# Altium schematic sheet DisplayPort.SchDoc
size A3; SheetNumber: 7; SheetTotal: 13
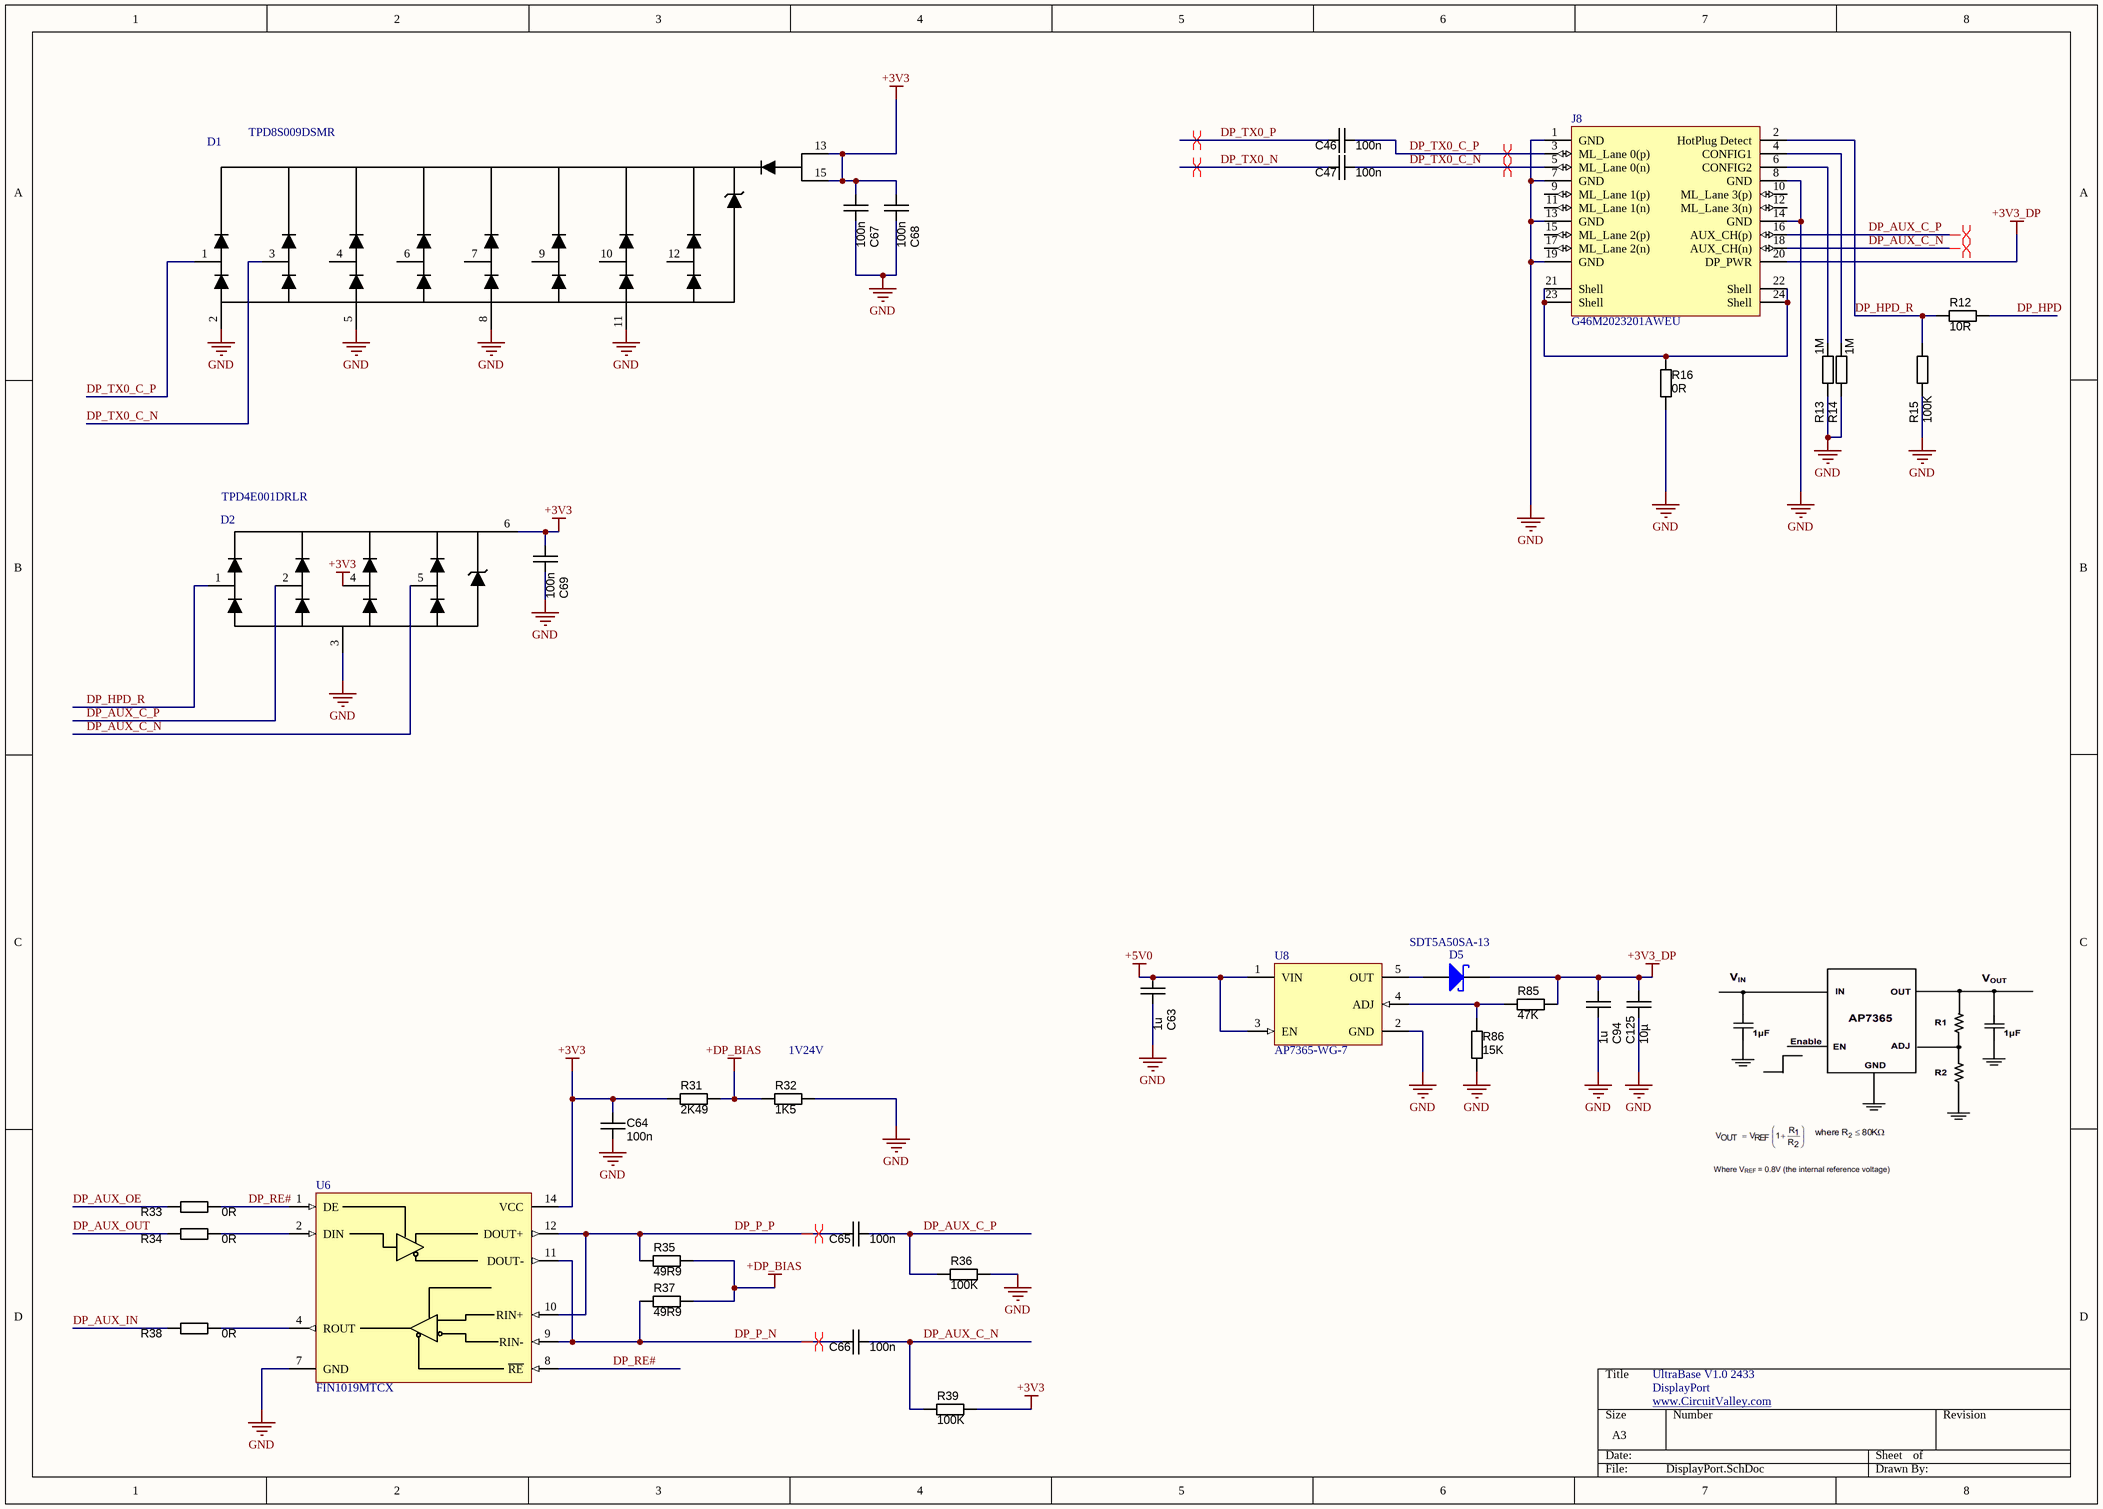
[diagram p0: DisplayPort.SchDoc]

## Parts
C46  100n  [CAPC1005N]
C47  100n  [CAPC1005N]
C63  1u  [CAPC1608N]
C64  100n  [CAPC1608N]
C65  100n  [CAPC1005N]
C66  100n  [CAPC1005N]
C67  100n  [CAPC1608N]
C68  100n  [CAPC1608N]
C69  100n  [CAPC1608N]
C94  1u  [CAPC1608N]
C125  10µ  [CAPC3225N]
D1  TPD8S009DSMR  [WSON-15]
D2  TPD4E001DRLR  [SOT5x3]
D5  SDT5A50SA-13  [DO-214AC]
J8  G46M2023201AWEU  [G46M2023201AWEU]
R12  value 10R  [RESC1608N]  (hidden comment: RES_NL_0603)
R13  value 1M  [RESC1608N]  (hidden comment: RES_NL_0603)
R14  value 1M  [RESC1608N]  (hidden comment: RES_NL_0603)
R15  value 100K  [RESC1608N]  (hidden comment: RES_NL_0603)
R16  value 0R  [RESC1608N]  (hidden comment: RES_NL_0603)
R31  value 2K49  [RESC1608N]  (hidden comment: RES_NL_0603)
R32  value 1K5  [RESC1608N]  (hidden comment: RES_NL_0603)
R33  value 0R  [RESC1608N]  (hidden comment: RES_NL_0603)
R34  value 0R  [RESC1608N]  (hidden comment: RES_NL_0603)
R35  value 49R9  [RESC1608N]  (hidden comment: RES_NL_0603)
R36  value 100K  [RESC1608N]  (hidden comment: RES_NL_0603)
R37  value 49R9  [RESC1608N]  (hidden comment: RES_NL_0603)
R38  value 0R  [RESC1608N]  (hidden comment: RES_NL_0603)
R39  value 100K  [RESC1608N]  (hidden comment: RES_NL_0603)
R85  value 47K  [RESC1608N]  (hidden comment: RES_NL_0603)
R86  value 15K  [RESC1608N]  (hidden comment: RES_NL_0603)
U6  FIN1019MTCX  [TSSOP14 PW G14]
U8  AP7365-WG-7  [SOT23-5]

## Nets
+3V3: C64.1 C67.1 C68.1 C69.1 D1.13 D1.15 D2.4 D2.6 R31.1 R39.1 U6.14(VCC)
+3V3_DP: C94.1 C125.1 D5.2(K) J8.20(DP_PWR) R85.2
+5V0: C63.1 U8.1(VIN) U8.3(EN)
+DP_BIAS: R31.2 R32.1 R35.1 R37.2
GND: C63.2 C64.2 C67.2 C68.2 C69.2 C94.2 C125.2 D1.2 D1.5 D1.8 D1.11 D2.3 J8.1(GND) J8.7(GND) J8.8(GND) J8.13(GND) J8.14(GND) J8.19(GND) R13.2 R14.2 R15.2 R16.2 R32.2 R36.1 R86.1 U6.7(GND) U8.2(GND)
DP_AUX_C_N: C66.2 D2.5 J8.18(AUX_CH(n)) R39.2
DP_AUX_C_P: C65.2 D2.2 J8.16(AUX_CH(p)) R36.2
DP_AUX_IN: R38.1
DP_AUX_OE: R33.1
DP_AUX_OUT: R34.1
DP_HPD: R12.2
DP_HPD_R: D2.1 J8.2(HotPlug_Detect) R12.1 R15.1
DP_P_N: C66.1 R37.1 U6.9(RIN-) U6.11(DOUT-)
DP_P_P: C65.1 R35.2 U6.10(RIN+) U6.12(DOUT+)
DP_RE#: R33.2 U6.1(DE) U6.8(~{RE})
DP_TX0_C_N: C47.2 D1.3 J8.5(ML_Lane_0(n))
DP_TX0_C_P: C46.2 D1.1 J8.3(ML_Lane_0(p))
DP_TX0_N: C47.1
DP_TX0_P: C46.1
NetD5_1: D5.1(A) U8.5(OUT)
NetJ8_4: J8.4(CONFIG1) R14.1
NetJ8_6: J8.6(CONFIG2) R13.1
NetJ8_21: J8.21(Shell) J8.22(Shell) J8.23(Shell) J8.24(Shell) R16.1
NetR34_2: R34.2 U6.2(DIN)
NetR38_2: R38.2 U6.4(ROUT)
NetR85_1: R85.1 R86.2 U8.4(ADJ)

Not connected (* = marked no-connect by the designer): D1 4 6 7 9 10 12; J8 9(ML_Lane_1(p)) 10(ML_Lane_3(p)) 11(ML_Lane_1(n)) 12(ML_Lane_3(n)) 15(ML_Lane_2(p)) 17(ML_Lane_2(n))

## Layout directives
differential pair: DP_AUX_C_N, DP_AUX_C_P, DP_P_N, DP_P_P, DP_TX0_C_N, DP_TX0_C_P, DP_TX0_N, DP_TX0_P

## Notes on the sheet
- (near R32) 1V24V
- UltraBase V1.0 2433
- DisplayPort
- www.CircuitValley.com <http://www.CircuitValley.com>

## Library data of the parts
C46 C47 C65 C66 = CAPC_100n_0402_16V_10%: Capacitor SMD Cer 100nF 10% 16V X5R 0402; Manufacturer 1: AVX Corporation; Manufacturer Part Number 1: 0402YD104KAT2A; Ratings: 16V; X7R; Tolerance: ±10%; Operating Temperature: -55°C ~ 125°C; Package / Case: 0402 (1005 Metric); Size / Dimension: 0.039" L x 0.020" W (1.00mm x 0.50mm); Supplier 1: Digi-Key; Supplier Part Number 1: 478-1126-1-ND; ComponentLink1URL: http://www.avx.com/docs/Catalogs/cx5r.pdf; ComponentLink1Description: http://www.avx.com/docs/Catalogs/cx5r.pdf; Supplier 2: Digi-Key; Supplier Part Number 2: 311-1347-1-ND; Manufacturer 2: Yageo; Manufacturer Part Number 2: CC0402KRX5R7BB104; ComponentLink2URL: http://www.yageo.com/documents/recent/UPY-GPHC_X5R_4V-to-50V_12.pdf; ComponentLink2Description: http://www.yageo.com/documents/recent/UPY-GPHC_X5R_4V-to-50V_12.pdf; Value: 100n
C63 C67-C69 C94 = CAPC_120p_0603_C0G_50V: Capacitor SMD Cer 120pF 10% 50V C0G 0603; Manufacturer 1: Kemet; Manufacturer Part Number 1: C0603C121K5GACTU; Ratings: 50V; C0G; Tolerance: ±10%; Operating Temperature: -55°C ~ 125°C; Package / Case: 0603 (1608 Metric); Supplier 1: Mouser; Supplier Part Number 1: 80-C0603C121K5G
  C63 C94: Value: 1u
  C67-C69: Value: 100n
C64 = CAPC_1n_0603_100V: Capacitor SMD Cer 1nF 10% 100V X7R 0603; Manufacturer 1: Murata Electronics North America; Manufacturer Part Number 1: GCM188R72A102KA37D; Ratings: 100V; X7R; Material: ceramic; Package / Case: 0603 (1608 metric); Tolerance: ±10%; Supplier 1: Digi-Key; Supplier Part Number 1: 490-4780-1-ND; Operating Temperature: -55°C ~ 125°C; Size / Dimension: 0.063" L x 0.031" W (1.60mm x 0.80mm); Thickness (Max): 0.035" (0.90mm); ComponentLink1URL: http://search.murata.co.jp/Ceramy/image/img/PDF/ENG/GCM188R72A102KA37.pdf; ComponentLink1Description: http://search.murata.co.jp/Ceramy/image/img/PDF/ENG/GCM188R72A102KA37.pdf; Value: 100n
C125 = CAPC_10u_1210_50V: Capacitor SMD Cer 10uF 20% 16V X5R 1210; Manufacturer 1: Taiyo Yuden; Manufacturer Part Number 1: UMK325BJ106MM-T; Ratings: 50V; X5R; Material: ceramic; Package / Case: 1210 (3225 Metric); Tolerance: ±20%; Size / Dimension: 0.126" L x 0.098" W (3.20mm x 2.50mm); Supplier 1: Digi-Key; Supplier Part Number 1: 587-2225-1-ND; Value: 10µ
D1 = TPD8S009DSMR: Display Port ESD
D2 = TPD4E001DRLR: ESD Protection
D5 = Diode
J8 = G46M2023201AWEU: Mini Display Port
R12-R16 R31-R39 R85 R86 = RES_NL_0603: Resistor, SMD chip; Manufacturer 1: Royal Ohm; Ratings: 1/10 W; Tolerance: ±5%; Package / Case: 0603 (1608 metric)
U6 = FIN1019MTCX: Differential Buffer
U8 = AP7365-WG-7: LDO Reg ADJ 600mA